# Altium schematic sheet MAIN.SchDoc
size A3
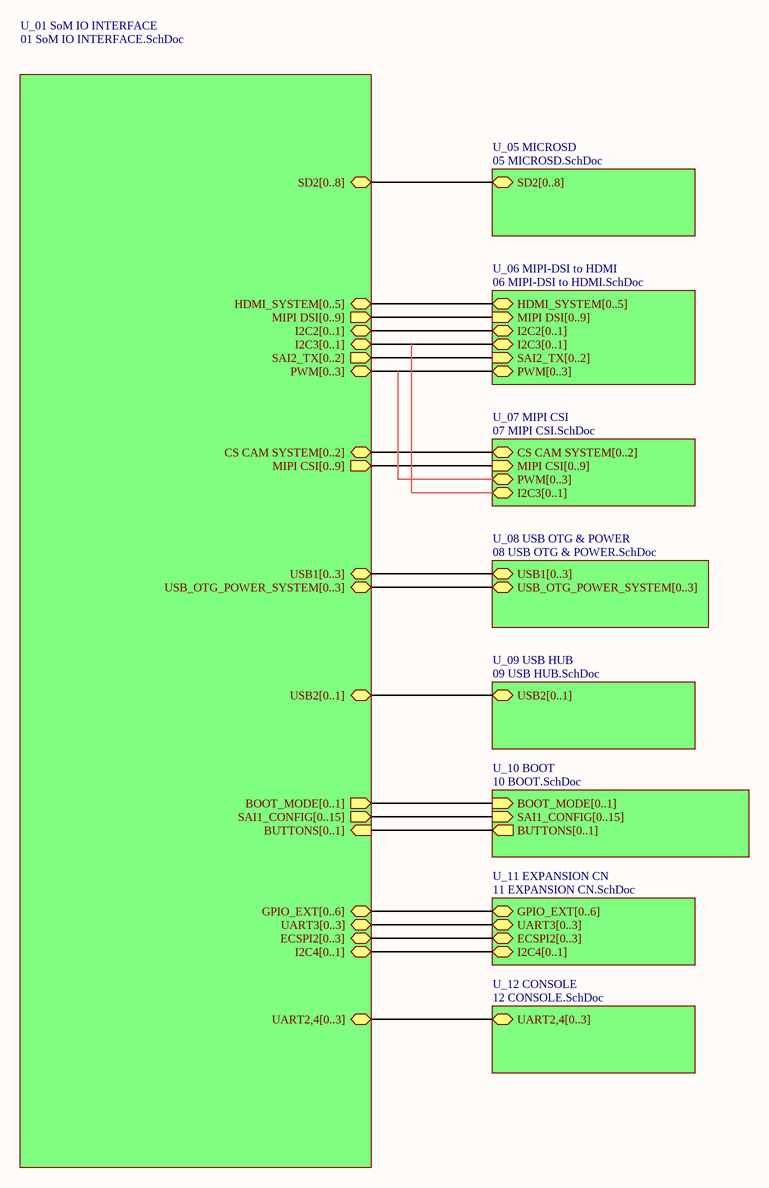
[diagram p0: MAIN.SchDoc]

## Sub-sheets
U_01 SoM IO INTERFACE = 01 SoM IO INTERFACE.SchDoc: MIPI DSI[0..9] (out), MIPI CSI[0..9] (out), USB1[0..3] (bidir), USB2[0..1] (bidir), UART3[0..3] (bidir), ECSPI2[0..3] (bidir), I2C2[0..1] (bidir), I2C3[0..1] (bidir), I2C4[0..1] (bidir), SD2[0..8] (bidir), PWM[0..3] (bidir), GPIO_EXT[0..6] (bidir), SAI1_CONFIG[0..15] (out), BUTTONS[0..1] (in), CS CAM SYSTEM[0..2] (bidir), USB_OTG_POWER_SYSTEM[0..3] (bidir), HDMI_SYSTEM[0..5] (bidir), BOOT_MODE[0..1] (out), UART2,4[0..3] (bidir), SAI2_TX[0..2] (out)
U_05 MICROSD = 05 MICROSD.SchDoc: SD2[0..8] (bidir)
U_06 MIPI-DSI to HDMI = 06 MIPI-DSI to HDMI.SchDoc: HDMI_SYSTEM[0..5] (bidir), MIPI DSI[0..9] (in), I2C2[0..1] (bidir), I2C3[0..1] (bidir), SAI2_TX[0..2] (in), PWM[0..3] (bidir)
U_07 MIPI CSI = 07 MIPI CSI.SchDoc: CS CAM SYSTEM[0..2] (bidir), MIPI CSI[0..9] (in), PWM[0..3] (bidir), I2C3[0..1] (bidir)
U_08 USB OTG & POWER = 08 USB OTG & POWER.SchDoc: USB1[0..3] (bidir), USB_OTG_POWER_SYSTEM[0..3] (bidir)
U_09 USB HUB = 09 USB HUB.SchDoc: USB2[0..1] (bidir)
U_10 BOOT = 10 BOOT.SchDoc: BUTTONS[0..1] (out), BOOT_MODE[0..1] (in), SAI1_CONFIG[0..15] (in)
U_11 EXPANSION CN = 11 EXPANSION CN.SchDoc: GPIO_EXT[0..6] (bidir), UART3[0..3] (bidir), ECSPI2[0..3] (bidir), I2C4[0..1] (bidir)
U_12 CONSOLE = 12 CONSOLE.SchDoc: UART2,4[0..3] (bidir)

## Notes on the sheet
- Sheet Title:
- Inventron
- Size:
- Drawn By:
- Revision:
- Project:
- Checked By:
- A4
- Sheet
- of
- Budotek Teknopark
- Dudullu OSB
- Des 2. Cadde No:8/30
- Umraniye / ISTANBUL
- Electronics and Software
- Date:
- Time:
- ©2020 Inventron Electronics and Software. All rights reserved.